# Altium schematic sheet 02.USB_2_UART.SchDoc
size A4; DocumentNumber: 03; SheetNumber: 3; SheetTotal: 8; Page: USB to UART
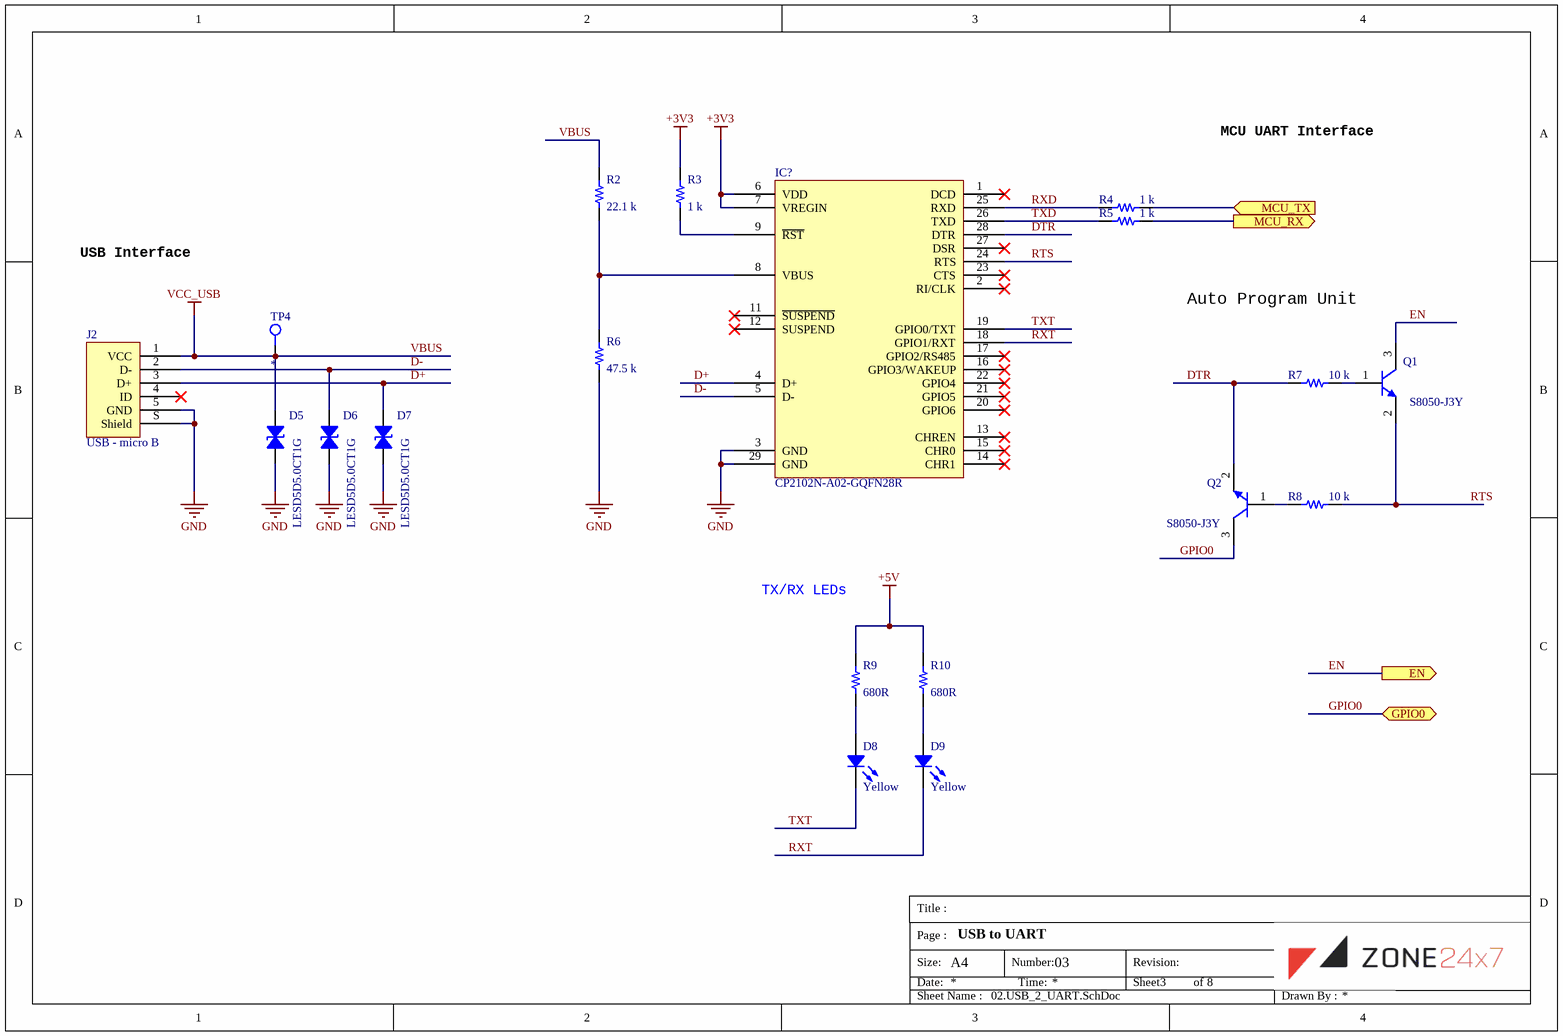
[diagram p0: 02.USB_2_UART.SchDoc]

## Parts
D5  LESD5D5.0CT1G  [SOD-523]
D6  LESD5D5.0CT1G  [SOD-523]
D7  LESD5D5.0CT1G  [SOD-523]
D8  Yellow  [LED 0603_1608 YELLOW]
D9  Yellow  [LED 0603_1608 YELLOW]
IC?  CP2102N-A02-GQFN28R  [IC_CP2102N-A02-GQFN28R]
J2  USB - micro B  [FCI USB 10118193-0001LF]
Q1  S8050-J3Y  [DIODES SOT-23-3]
Q2  S8050-J3Y  [DIODES SOT-23-3]
R2  22.1 k  [RES 0603_1608]
R3  1 k  [RES 0603_1608]
R4  1 k  [RES 0603_1608]
R5  1 k  [RES 0603_1608]
R6  47.5 k  [RES 0603_1608]
R7  10 k  [RES 0603_1608]
R8  10 k  [RES 0603_1608]
R9  680R  [RES 0603_1608]
R10  680R  [RES 0603_1608]
TP4  *  [TP-2ED-1ID]

## Ports
EN (out), GPIO0 (bidir), MCU_RX (out), MCU_TX (in)

## Nets
+3V3: IC?.6(VDD) IC?.7(VREGIN) R3.2
+5V: R9.2 R10.2
GND: D5.1 D6.1 D7.1 IC?.3(GND) IC?.29(GND) J2.5(GND) J2.S(Shield) R6.1
VBUS: D5.2 J2.1(VCC) R2.1 TP4.1  [also labelled VCC_USB]
D+: D7.2 IC?.4(D+) J2.3(D+)
D-: D6.2 IC?.5(D-) J2.2(D-)
DTR: IC?.28(DTR) Q2.2(E) R7.2
EN: Q1.3(C) ; port EN
GPIO0: Q2.3(C) ; port GPIO0
MCU_RX: R5.1 ; port MCU_RX
MCU_TX: R4.1 ; port MCU_TX
RTS: IC?.24(RTS) Q1.2(E) R8.1
RXD: IC?.25(RXD) R4.2
RXT: D9.2 IC?.18(GPIO1/RXT)
TXD: IC?.26(TXD) R5.2
TXT: D8.2 IC?.19(GPIO0/TXT)
NetD8_1: D8.1 R9.1
NetD9_1: D9.1 R10.1
NetIC?_8: IC?.8(VBUS) R2.2 R6.2
NetIC?_9: IC?.9(~{RST}) R3.1
NetQ1_1: Q1.1(B) R7.1
NetQ2_1: Q2.1(B) R8.2

Not connected (* = marked no-connect by the designer): IC? 1(DCD)* 2(RI/CLK)* 11(~{SUSPEND})* 12(SUSPEND)* 13(CHREN)* 14(CHR1)* 15(CHR0)* 16(GPIO3/WAKEUP)* 17(GPIO2/RS485)* 20(GPIO6)* 21(GPIO5)* 22(GPIO4)* 23(CTS)* 27(DSR)*; J2 4(ID)*

## Notes on the sheet
- MCU UART Interface
- USB Interface
- Auto Program Unit
- TX/RX LEDs
- Title :
- Size:
- Date:
- Page :
- A4
- Number:
- Time:
- Revision:
- Sheet
- of
- Sheet Name :
- Drawn By :

## Library data of the parts
D5-D7 = Diode TVS: 5.6V 18.6V 5V Bi-Directional SOD-523  ESD Protection Devices ROHS; Manufacturer: LRC; Manufacturer Part Number: LESD5D5.0CT1G; JLC Part Number: C383211
D8 D9 = 5990040007F: 无色透明透镜 -40℃~+85℃ 572nm Green-yellow 120° 60mW 0603 Light Emitting Diodes (LED) ROHS; Manufacturer Part Number: MHT192JGCT; Manufacturer: MEIHUA; JLC Part Number: C473820
IC? = Silicon Labs - CP2102N QFN28: USB转UART UART QFN-28-EP(5x5) USB ICs ROHS; Manufacturer Part Number: CP2102N-A02-GQFN28R; Manufacturer: Silicon Labs; JLC Part Number: C964632
J2 = 10118193-0001LF: USB 2.0 1 Surface Mount 5P Female -30℃~+80℃ Micro-B SMD USB Connectors ROHS; Manufacturer Part Number: MicroQTJ; Manufacturer: SHOU HAN; Specifications: USB 2.0; Connector Type: USB - micro B; JLC Part Number: C404968
Q1 Q2 = BCX41TA: 25V 300mW 500mA NPN SOT-23 Bipolar Transistors - BJT ROHS; Manufacturer: MDD; Manufacturer Part Number: S8050-J3Y; JLC Part Number: C364312
R2 = RMCF0603FT22K1: 100mW ±100ppm/℃ ±1% 22.1kΩ 0603 Chip Resistor - Surface Mount ROHS; Manufacturer Part Number: RS-03K2212FT; Manufacturer: FH (Guangdong Fenghua Advanced Tech); Value: 22.1 k; JLC Part Number: C310274
R3-R5 = CPF0603B1K0E: 100mW ±100ppm/℃ ±1% 1kΩ 0603 Chip Resistor - Surface Mount ROHS; Manufacturer Part Number: RTT031001FTP; Value: 1 k; JLC Part Number: C103198
R6 = ERJ-PB3B4752V: 100mW Thick Film Resistors ±100ppm/℃ ±1% 47.5kΩ 0603 Chip Resistor - Surface Mount ROHS; Manufacturer Part Number: WR06X4752FTL; Manufacturer: Walsin Tech Corp; Value: 47.5 k; JLC Part Number: C168326
R7 R8 = CPF0603B1K0E: 100mW Thick Film Resistors ±100ppm/℃ ±5% 10kΩ 0603 Chip Resistor - Surface Mount ROHS; Manufacturer Part Number: RTT03103JTP; Manufacturer: RALEC; Value: 10 k; JLC Part Number: C103210
R9 R10 = CRCW0603150RFKEA: 100mW Thick Film Resistors ±100ppm/℃ ±1% 680Ω 0603 Chip Resistor - Surface Mount ROHS; Manufacturer Part Number: RC0603FR-07680RL; Manufacturer: YAGEO; Value: 680R; JLC Part Number: C112310
TP4 = TP-2ED-1ID: Test point-via type 2mm External diameter  1mm internal diameter; Value: *